# Altium schematic sheet SDCard.SchDoc
size A
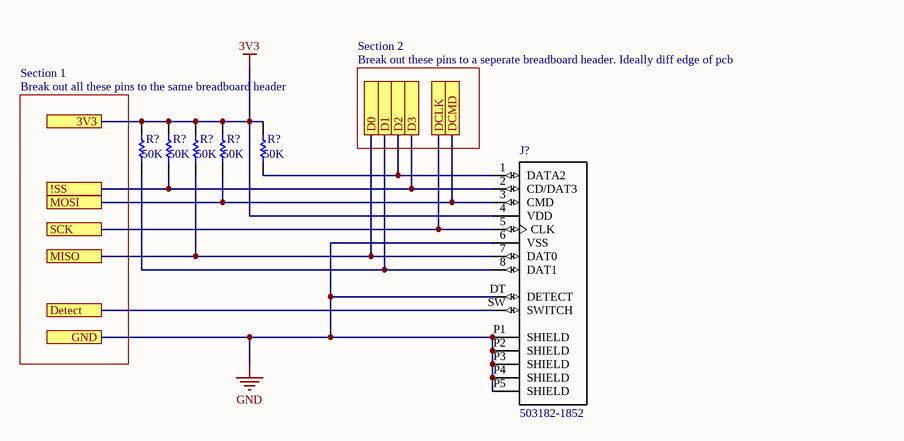
[diagram p0: SDCard.SchDoc]

## Parts
(Parts that share a designator on the sheet are numbered #1, #2 ... from top to bottom, then left to right.)
J?  503182-1852  [*MOLEX_503182-1852_503182-1852(Primary)]
R?#1  value 50K  [AXIAL-0.3]  (hidden comment: Res1)
R?#2  value 50K  [AXIAL-0.3]  (hidden comment: Res1)
R?#3  value 50K  [AXIAL-0.3]  (hidden comment: Res1)
R?#4  value 50K  [AXIAL-0.3]  (hidden comment: Res1)
R?#5  value 50K  [AXIAL-0.3]  (hidden comment: Res1)

## Sub-sheets
Section 1 = Break out all these pins to the same breadboard header: no entries
Section 2 = Break out these pins to a seperate breadboard header. Ideally diff edge of pcb: no entries

## Ports
3V3, !SS, D0, D1, D2, D3, DCLK, DCMD, Detect, GND, MISO, MOSI, SCK

## Nets
3V3: J?.4(VDD) R?#1.1 R?#2.1 R?#3.1 R?#4.1 R?#5.1 ; port 3V3
GND: J?.6(VSS) J?.DT(DETECT) J?.P1(SHIELD) J?.P2(SHIELD) J?.P3(SHIELD) J?.P4(SHIELD) J?.P5(SHIELD) ; port GND
!SS: J?.2(CD/DAT3) R?#2.2 ; port !SS, port D3
D0: J?.7(DAT0) R?#3.2 ; port MISO, port D0
D1: J?.8(DAT1) R?#1.2 ; port D1
D2: J?.1(DATA2) R?#5.2 ; port D2
DCLK: J?.5(CLK) ; port SCK, port DCLK
DCMD: J?.3(CMD) R?#4.2 ; port MOSI, port DCMD
Detect: J?.SW(SWITCH) ; port Detect

## Library data of the parts
J? = 503182-1852: / 10 _8 + 2_ Position Card Connector microSDâ„¢ Surface Mount, Right Angle Gold /; MF: Molex; MP: 5031821852; Digi-Key_Purchase_URL: https://www.digikey.com/product-detail/en/molex/5031821852/WM12834CT-ND/5823232?utm_source=snapeda&utm_medium=aggregator&utm_campaign=symbol; Package: None; SnapEDA_Link: https://www.snapeda.com/parts/5031821852/Molex/view-part/46835/?ref=snap; Digi-Key_Part_Number: WM12834CT-ND; Value: *
R?#1-R?#5 = Res1: Resistor; Published: 8-Jun-2000; LatestRevisionDate: 17-Jul-2002; LatestRevisionNote: Re-released for DXP Platform.; PackageReference: AXIAL-0.3; Publisher: Altium Limited; PackageDescription: Axial Device, Thru-Hole; 2 Leads; 0.3 in Pin Spacing